# Altium project CDA_bluetoothBoard.PrjPcb
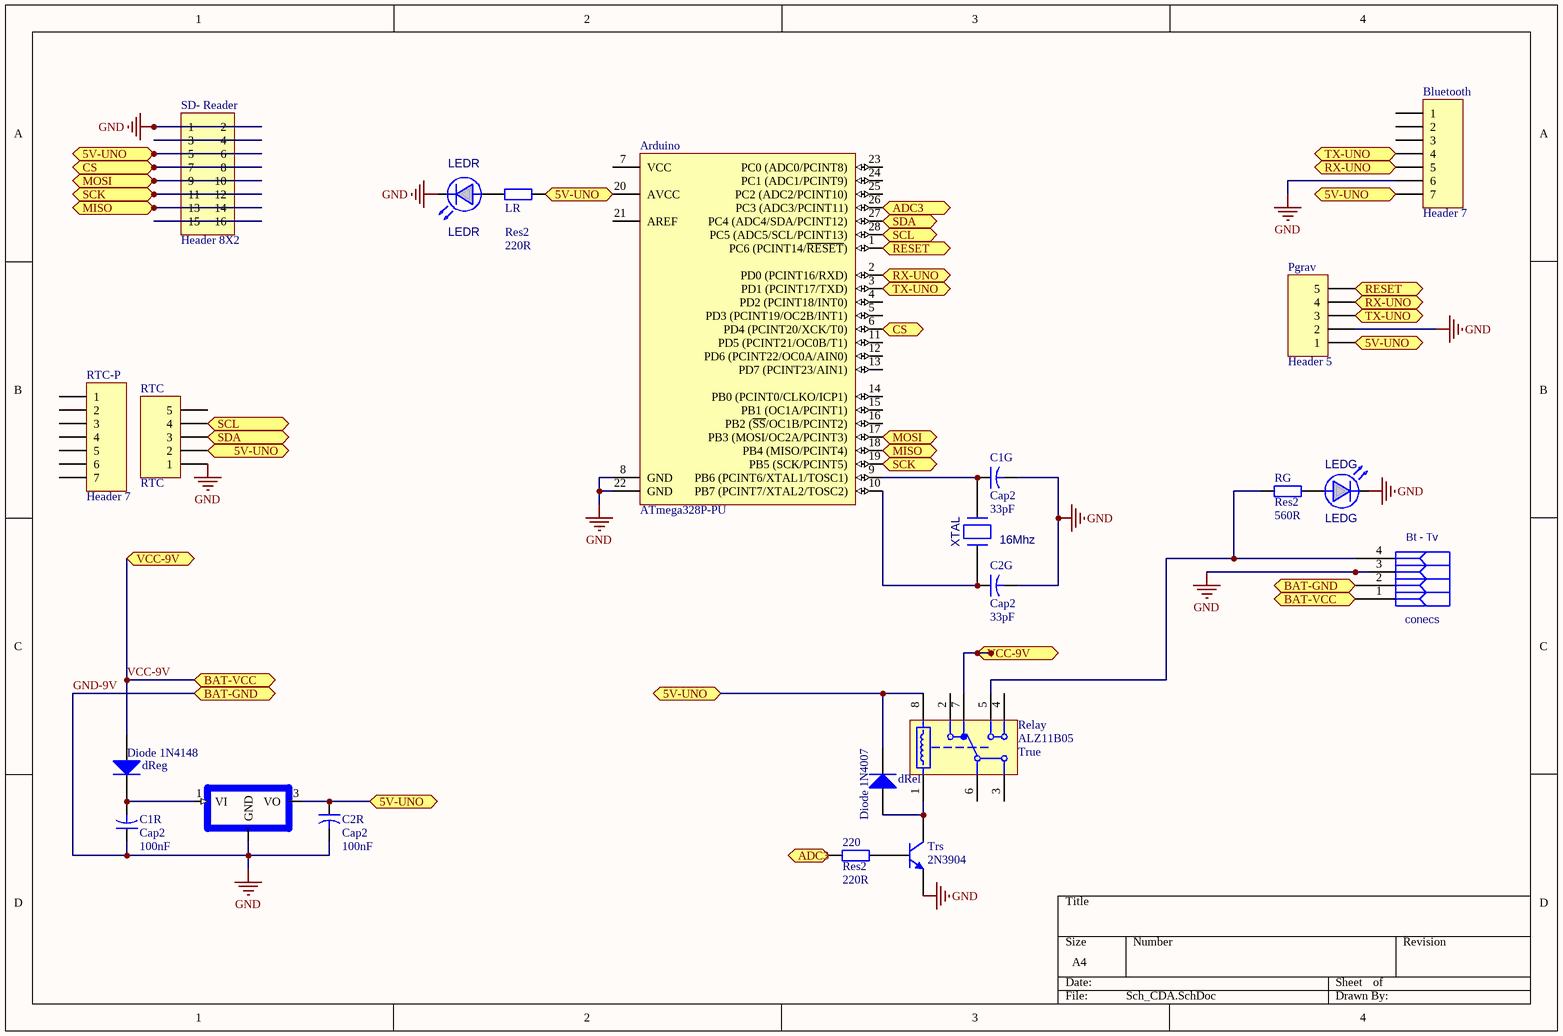
[diagram p0: Sch_CDA.SchDoc]
1 sheet, 22 parts. Net scope: flat (ports and power ports of the same name join across sheets).
Board file: PCB_CDA.PcbDoc

## Sheet Sch_CDA.SchDoc
size A4

### Parts
220  Res2  value 220R  [AXIAL-0.4]
Arduino  ATmega328P-PU  [28P3]
Bluetooth  Header 7  [HDR1X7]
C1G  Cap2  value 33pF  [CAPR5-4X5]
C1R  Cap2  value 100nF  [CAPR5-4X5]
C2G  Cap2  value 33pF  [CAPR5-4X5]
C2R  Cap2  value 100nF  [CAPR5-4X5]
conecs  Bt - Tv  [AK550/4]
dReg  Diode 1N4148  [DO-35]
dRel  Diode 1N4007  [DO-41]
LEDG  value LEDG  [LED100]  (hidden comment: LED)
LEDR  value LEDR  [LED100]  (hidden comment: LED)
LR  Res2  value 220R  [AXIAL-0.4]
Pgrav  Header 5  [HDR1X5]
Reg  7805  [TO92-]  (value not drawn)
Relay  ALZ11B05  Pb-Free: True  [DS2Y]
RG  Res2  value 560R  [AXIAL-0.4]
RTC  RTC  [HDR1X5]
RTC-P  Header 7  [HDR1X7]
SD-_Reader  Header 8X2  [HDR2X8]
Trs  2N3904  [TO92-]
XTAL  value 16Mhz  [CRISTAL]  (hidden comment: CRISTAL)

### Ports
5V-UNO, ADC3, BAT-GND, BAT-VCC, CS, MISO, MOSI, RESET, RX-UNO, SCK, SCL, SDA, TX-UNO, VCC-9V

### Nets
GND-9V: Arduino.8(GND) Arduino.22(GND) Bluetooth.6 C1G.2 C1R.1 C2G.2 C2R.2 conecs.2 conecs.3 LEDG.2(K) LEDR.2(K) Pgrav.2 Reg.2(GND) RTC.1 SD-_Reader.1 SD-_Reader.2 Trs.1(E) ; port BAT-GND  [also labelled GND]
VCC-9V: conecs.1 dReg.1(A) Relay.7 ; port VCC-9V, port BAT-VCC
Net220_1: 220.1 Arduino.26(PC3_(ADC3/PCINT11)) ; port ADC3
Net220_2: 220.2 Trs.2(B)
NetArduino_1: Arduino.1(PC6_(PCINT14/~{RESET})) Pgrav.5 ; port RESET
NetArduino_2: Arduino.2(PD0_(PCINT16/RXD)) Bluetooth.5 Pgrav.4 ; port RX-UNO
NetArduino_3: Arduino.3(PD1_(PCINT17/TXD)) Bluetooth.4 Pgrav.3 ; port TX-UNO
NetArduino_6: Arduino.6(PD4_(PCINT20/XCK/T0)) SD-_Reader.7 SD-_Reader.8 ; port CS
NetArduino_9: Arduino.9(PB6_(PCINT6/XTAL1/TOSC1)) C1G.1 XTAL.2
NetArduino_10: Arduino.10(PB7_(PCINT7/XTAL2/TOSC2)) C2G.1 XTAL.1
NetArduino_17: Arduino.17(PB3_(MOSI/OC2A/PCINT3)) SD-_Reader.9 SD-_Reader.10 ; port MOSI
NetArduino_18: Arduino.18(PB4_(MISO/PCINT4)) SD-_Reader.13 SD-_Reader.14 ; port MISO
NetArduino_19: Arduino.19(PB5_(SCK/PCINT5)) SD-_Reader.11 SD-_Reader.12 ; port SCK
NetArduino_20: Arduino.20(AVCC) Bluetooth.7 C2R.1 dRel.2(K) LR.2 Pgrav.1 Reg.3(VO) Relay.8 RTC.2 SD-_Reader.5 SD-_Reader.6 ; port 5V-UNO
NetArduino_27: Arduino.27(PC4_(ADC4/SDA/PCINT12)) RTC.3 ; port SDA
NetArduino_28: Arduino.28(PC5_(ADC5/SCL/PCINT13)) RTC.4 ; port SCL
NetC1R_2: C1R.2 dReg.2(K) Reg.1(VI)
Netconecs_4: conecs.4 Relay.5 RG.1
NetdRel_1: dRel.1(A) Relay.1 Trs.3(C)
NetLEDG_1: LEDG.1(A) RG.2
NetLEDR_1: LEDR.1(A) LR.1
NetSD-_Reader_3: SD-_Reader.3 SD-_Reader.4
NetSD-_Reader_15: SD-_Reader.15 SD-_Reader.16

Not connected (* = marked no-connect by the designer): Arduino 4(PD2_(PCINT18/INT0)) 5(PD3_(PCINT19/OC2B/INT1)) 7(VCC) 11(PD5_(PCINT21/OC0B/T1)) 12(PD6_(PCINT22/OC0A/AIN0)) 13(PD7_(PCINT23/AIN1)) 14(PB0_(PCINT0/CLKO/ICP1)) 15(PB1_(OC1A/PCINT1)) 16(PB2_(~{SS}/OC1B/PCINT2)) 21(AREF) 23(PC0_(ADC0/PCINT8)) 24(PC1_(ADC1/PCINT9)) 25(PC2_(ADC2/PCINT10)); Bluetooth 1 2 3; Relay 2 3 4 6; RTC 5; RTC-P 1 2 3 4 5 6 7

### Library data of the parts
220 LR RG = Res2: Resistor; Published: 8-Jun-2000; LatestRevisionDate: 17-Jul-2002; LatestRevisionNote: Re-released for DXP Platform.; PackageReference: AXIAL-0.4; Publisher: Altium Limited; PackageDescription: Axial Device, Thru-Hole; 2 Leads; 0.4 in Pin Spacing
Arduino = ATmega328P-PU: 8-bit AVR Microcontroller, 32KB Flash, 1KB EEPROM, 2KB SRAM, 28-pin PDIP, Industrial Grade (-40°C to 85°C); Published: 1-Apr-2010; DatasheetVersion: revA, Jan-2010; PackageVersion: revB, Sep-2001; PackageReference: 28P3; Publisher: Altium Limited; PackageDescription: 28-lead (0.300"/7.62mm Wide) Plastic Dual Inline Package (PDIP); Supplier 1: Digi-Key; Supplier Part Number 1: ATMEGA328P-PU-ND; Supplier 2: Farnell; Supplier Part Number 2: 1715487; Supplier 3: Mouser; Supplier Part Number 3: 556-ATMEGA328P-PU; ComponentLink1Description: Manufacturer Link; ComponentLink1URL: http://www.atmel.com/products/avr/default.asp?; ComponentLink2Description: ATmega48A/48PA/88A/88PA/168A/168PA/328/328P Datasheet; ComponentLink2URL: http://www.atmel.com/dyn/resources/prod_documents/8271.pdf; ComponentLink3Description: ATmega48A/48PA/88A/88PA/168A/168PA/328/328P Summary; ComponentLink3URL: http://www.atmel.com/dyn/resources/prod_documents/8271S.pdf; ComponentLink4Description: Atmel.com Home; ComponentLink4URL: http://www.atmel.com
Bluetooth RTC-P = Header 7: Header, 7-Pin; LatestRevisionDate: 17-Jul-2002; LatestRevisionNote: Re-released for DXP Platform.; Publisher: Altium Limited
C1G C1R C2G C2R = Cap2: Capacitor; Published: 23-Sep-2002; PackageReference: CAPR5-4X5; Publisher: Altium Limited; PackageDescription: Capacitor; 2 Leads
conecs = BORNE 4X5.08: Value: *
dReg = Diode 1N4148: High Conductance Fast Diode; Published: 8-Jun-2000; LatestRevisionDate: 17-Jul-2002; LatestRevisionNote: Re-released for DXP Platform.; DatasheetVersion: 1997; PackageReference: DO-35; Publisher: Altium Limited; PackageDescription: Diode, Axial; Body 3.8 x 1.9 mm (LxDia. max), Lead Dia. 0.53 mm (max); Code_JEDEC: DO-204-AH; ComponentLink1Description: Manufacturer Link; ComponentLink1URL: http://www.fairchildsemi.com/; ComponentLink2Description: Datasheet; ComponentLink2URL: http://www.fairchildsemi.com/ds/1N%2F1N4148.pdf
dRel = Diode 1N4007: 1 Amp General Purpose Rectifier; Published: 8-Jun-2000; LatestRevisionDate: 17-Jul-2002; LatestRevisionNote: Re-released for DXP Platform.; DatasheetVersion: 1998; PackageVersion: Aug-1999; PackageReference: DO-41; Publisher: Altium Limited; PackageDescription: Diode, Axial; Body 5.2 x 2.7 mm (LxDia. max), Lead Dia. 0.86 mm (max); Code_JEDEC: DO-204-AL; ComponentLink1Description: Manufacturer Link; ComponentLink1URL: http://www.fairchildsemi.com/; ComponentLink2Description: Datasheet; ComponentLink2URL: http://www.fairchildsemi.com/ds/1N%2F1N4001.pdf
LEDG LEDR = LED: Light Emitting Diode
Pgrav RTC = Header 5: Header, 5-Pin; LatestRevisionDate: 17-Jul-2002; LatestRevisionNote: Re-released for DXP Platform.; Publisher: Altium Limited
Reg = 7805: 5V Positive IC TO-220 Voltage Reg IC TO-220 VOLTAGE REG 5V POSITIVE; MF: MCM Electronics; Availability: Unavailable; MP: 7805; Package: TO-220 MCM Electronics; Price: None; Value: *
Relay = ALZ11B05: LZ Relays, 5 V Coil Voltage, 400 mW Nominal Operating Power, -40 to 85 degC, 8-Pin LZ, Carton, Case, RoHS; Manufacturer: Panasonic; Coil Voltage: 5 V; Electrical Life: 1x10^5 (N.O.), 5x10^4 (N.C.); Max Switching Current: 16 A; Max Switching Voltage: 440 V AC; Mechanical Life(Min.operation): 1x10^7; Nominal Operating Power: 400 mW; DatasheetVersion: 201402-T; PackageVersion: ASCTB203E, 02/2014; PackageReference: LZ-8-2880x1250x1570; PackageDescription: 8-Pin Through Hole Terminal Package, Body 28.8 x 12.5 mm; Supplier 1: Mouser; Supplier Part Number 1: 769-ALZ11B05; Supplier 2: Digi-Key; Supplier Part Number 2: 255-2971-ND; Packing: Carton, Case; RoHS: True; Series: LZ Relays; Mounting Technology: Through Hole; PartNumber: ALZ11B05; ComponentLink1Description: Manufacturer URL; ComponentLink1URL: http://www3.panasonic.biz/ac/ae/index.jsp; ComponentLink2Description: Datasheet; ComponentLink2URL: http://www3.panasonic.biz/ac/e_download/control/relay/power/catalog/mech_eng_lz.pdf?f_cd=300372; ComponentLink3Description: Package Specification; ComponentLink3URL: http://www3.panasonic.biz/ac/e_download/control/relay/power/catalog/mech_eng_lz.pdf?f_cd=300372
SD-_Reader = Header 8X2: Header, 8-Pin, Dual row; LatestRevisionDate: 17-Jul-2002; LatestRevisionNote: Re-released for DXP Platform.; Publisher: Altium Limited
Trs = 2N3904: NPN General Purpose Amplifier; Published: 8-Jun-2000; LatestRevisionDate: 15-Jan-2003; LatestRevisionNote: PCB Footprint 'BCY-W3/D4.7' replaced; DatasheetVersion: 1997; PackageVersion: Sep-1998; PackageReference: TO-92A; Publisher: Altium Limited; PackageDescription: TO, Flat Index; 3 In-Line, Axial Leads; Body Dia. 4.5mm; Leads 0.51 x 0.48 mm (max); ComponentLink1Description: Manufacturer Link; ComponentLink1URL: http://www.fairchildsemi.com/; ComponentLink2Description: Datasheet; ComponentLink2URL: http://www.fairchildsemi.com/ds/2N%2F2N3904.pdf